# EAGLE design TeensyROM (EAGLE 7.7.0)
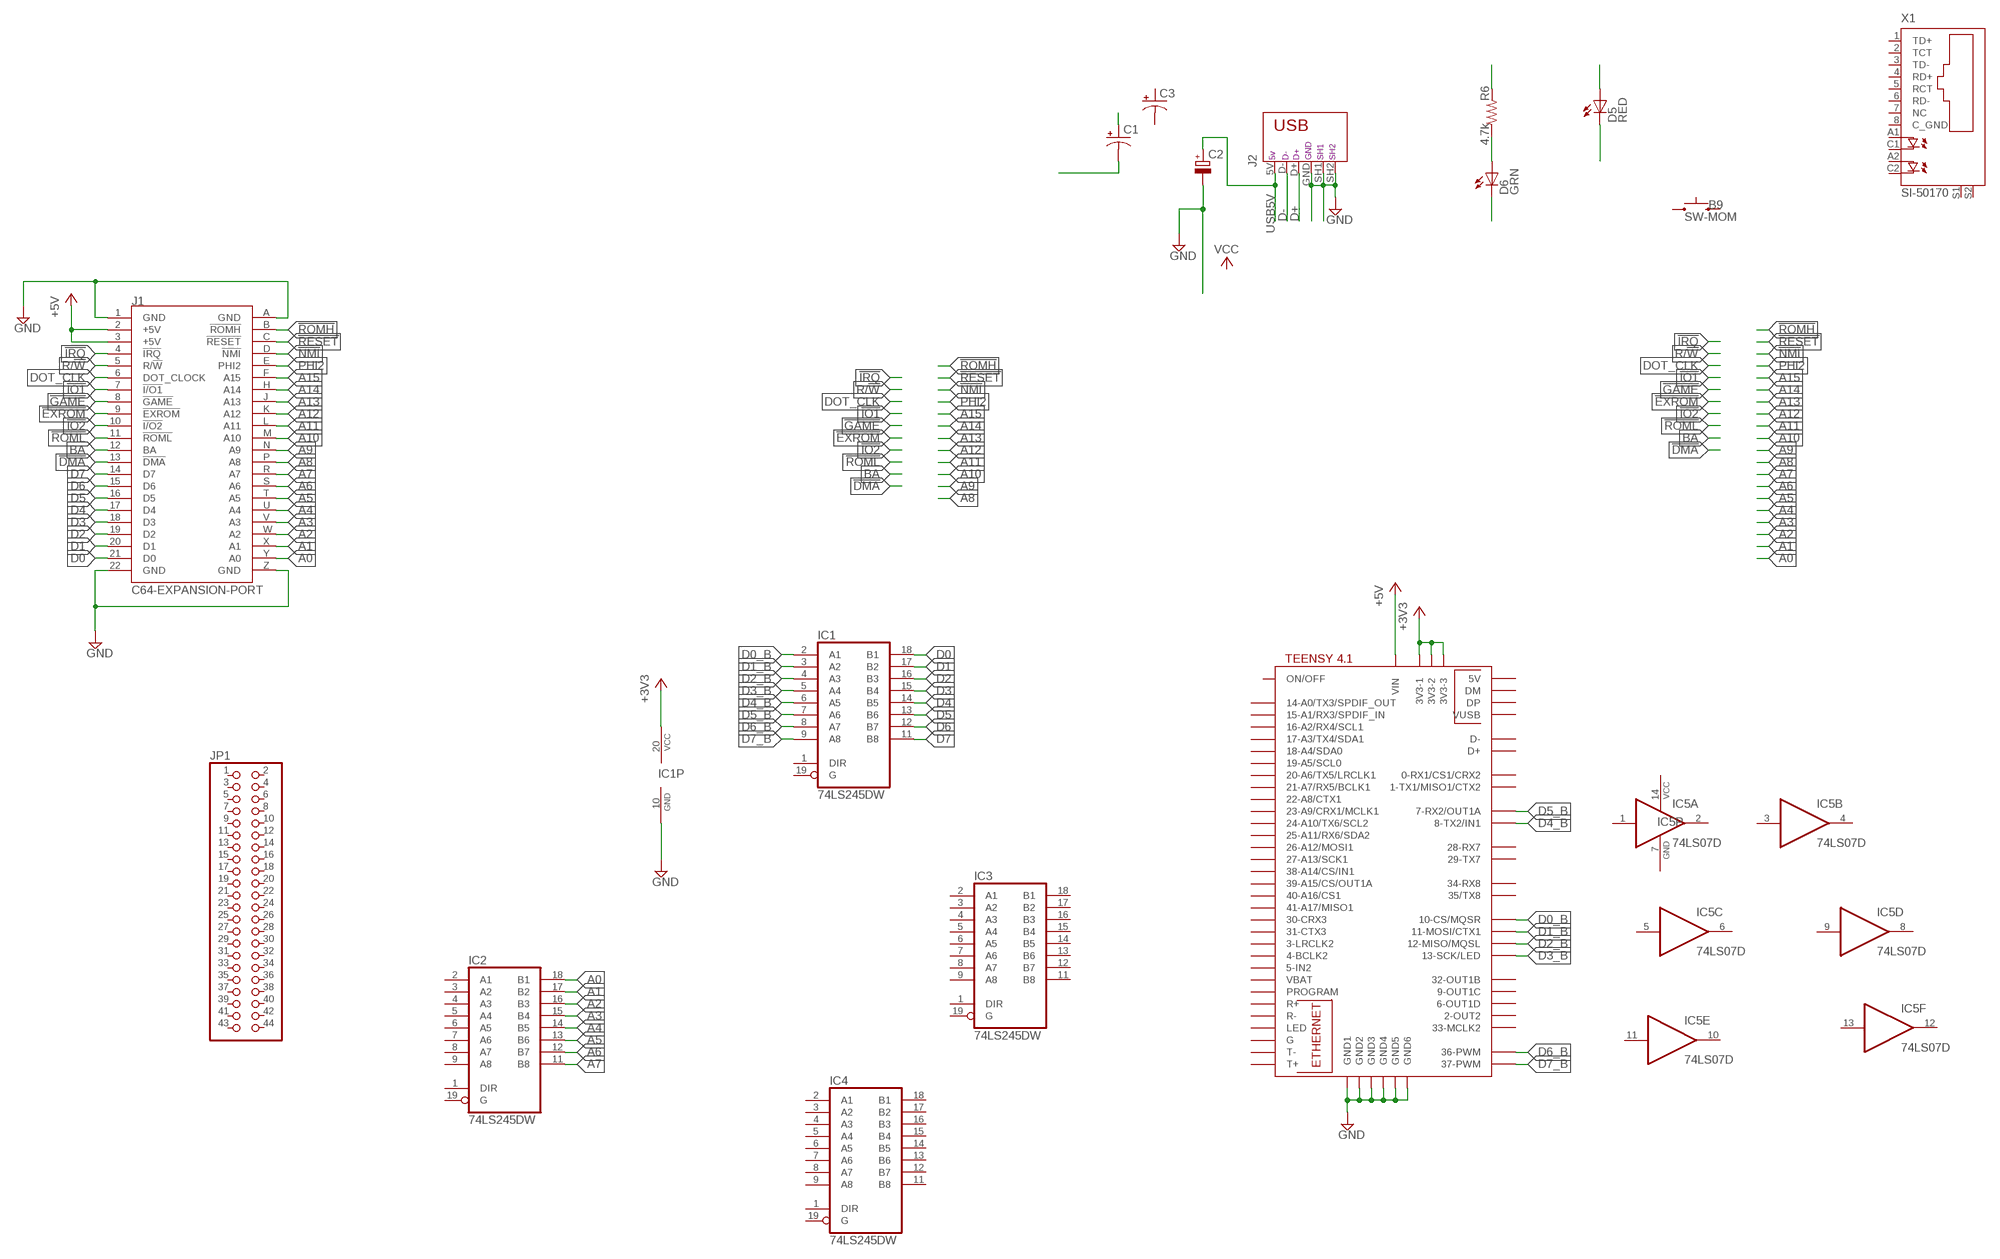
[diagram p0: schematic, sheet 1]

## Parts
B9  SW-MOM  SWITCH-MOMENTARY-2PTH  [TACTILE-PTH]
C1  CPOL-USE2.5-6  [E2,5-6]
C2  CPOL-EUA/3216-18W  [A/3216-18W]
C3  CPOL-USE2.5-6  [E2,5-6]
D5  RED  LED-3MM-RED  [LED-3MM-PTH]
D6  GRN  LED-3MM-GRN  [LED-3MM-PTH]
IC1  74LS245DW  [SO20W]
IC2  74LS245DW  [SO20W]
IC3  74LS245DW  [SO20W]
IC4  74LS245DW  [SO20W]
IC5  74LS07D  [SO14]
J1  C64-EXPANSION-PORT  C64-EXPANSIONPNARROW  [EXPANSIO_SQ]
J2  USB-787616  [USB]
JP1  PINHD-2X22  [2X22]
R6  4.7k  R-US_R0805  [R0805]
U$1  TEENSY41  [TEENSY41]
X1  SI-50170  [SI-50170]

## Nets
!DMA: J1.13(!DMA)
!EXROM: J1.9(!EXROM)
!GAME: J1.8(!GAME)
!IO1: J1.7(!I/O1)
!IO2: J1.10(!I/O2)
!IRQ: J1.4(!IRQ)
!NMI: J1.D(!NMI)
!RESET: J1.C(!RESET)
!ROMH: J1.B(!ROMH)
!ROML: J1.11(!ROML)
+3V3: IC1.20(VCC) U$1.3V3-1 U$1.3V3-2 U$1.3V3-3
+5V: J1.2(+5V) J1.3(+5V)
+5V1: C1.+
A0: IC2.18(B1) J1.Y(A0)
A1: IC2.17(B2) J1.X(A1)
A2: IC2.16(B3) J1.W(A2)
A3: IC2.15(B4) J1.V(A3)
A4: IC2.14(B5) J1.U(A4)
A5: IC2.13(B6) J1.T(A5)
A6: IC2.12(B7) J1.S(A6)
A7: IC2.11(B8) J1.R(A7)
A8: J1.P(A8)
A9: J1.N(A9)
A10: J1.M(A10)
A11: J1.L(A11)
A12: J1.K(A12)
A13: J1.J(A13)
A14: J1.H(A14)
A15: J1.F(A15)
B12: D5.K(C)
BA: J1.12(BA)
D0: IC1.18(B1) J1.21(D0)
D0_B: IC1.2(A1) U$1.10-CS\MQSR(10-CS/MQSR)
D1: IC1.17(B2) J1.20(D1)
D1_B: IC1.3(A2) U$1.11-MOSI/CTX1
D2: IC1.16(B3) J1.19(D2)
D2_B: IC1.4(A3) U$1.12-MISO/MQSL
D3: IC1.15(B4) J1.18(D3)
D3_B: IC1.5(A4) U$1.13-SCK/LED
D4: IC1.14(B5) J1.17(D4)
D4_B: IC1.6(A5) U$1.8-TX2/IN1
D5: IC1.13(B6) J1.16(D5)
D5_B: IC1.7(A6) U$1.7-RX2/OUT1A
D6: IC1.12(B7) J1.15(D6)
D6_B: IC1.8(A7) U$1.36-PWM
D7: IC1.11(B8) J1.14(D7)
D7_B: IC1.9(A8) U$1.37-PWM
D+: J2.D+
D-: J2.D-
DOT_CLK: J1.6(DOT_CLOCK)
GND: C2.- IC1.10(GND) J1.1(GND) J1.22(GND) J2.GND J2.SH1 J2.SH2 U$1.GND1 U$1.GND2 U$1.GND3 U$1.GND4 U$1.GND5 U$1.GND6
GND1: J1.A(GND) J1.Z(GND)
GND2: D6.K(C)
GND3: C1.-
N$1: D6.A R6.1
N$5: D5.A
PHI2: J1.E(PHI2)
R/!W: J1.5(R/!W)
USB5V: C2.+ J2.5V
VCC1 [vcc]: R6.2
Unconnected: B9.1 B9.3 C3.+ C3.- IC1.1(DIR) IC1.19(G) IC2.1(DIR) IC2.2(A1) IC2.3(A2) IC2.4(A3) IC2.5(A4) IC2.6(A5) IC2.7(A6) IC2.8(A7) IC2.9(A8) IC2.19(G) IC3.1(DIR) IC3.2(A1) IC3.3(A2) IC3.4(A3) IC3.5(A4) IC3.6(A5) IC3.7(A6) IC3.8(A7) IC3.9(A8) IC3.11(B8) IC3.12(B7) IC3.13(B6) IC3.14(B5) IC3.15(B4) IC3.16(B3) IC3.17(B2) IC3.18(B1) IC3.19(G) IC4.1(DIR) IC4.2(A1) IC4.3(A2) IC4.4(A3) IC4.5(A4) IC4.6(A5) IC4.7(A6) IC4.8(A7) IC4.9(A8) IC4.11(B8) IC4.12(B7) IC4.13(B6) IC4.14(B5) IC4.15(B4) IC4.16(B3) IC4.17(B2) IC4.18(B1) IC4.19(G) IC5.1(A:I) IC5.2(A:O) IC5.3(B:I) IC5.4(B:O) IC5.5(C:I) IC5.6(C:O) IC5.8(D:O) IC5.9(D:I) IC5.10(E:O) IC5.11(E:I) IC5.12(F:O) IC5.13(F:I) JP1.1 JP1.2 JP1.3 JP1.4 JP1.5 JP1.6 JP1.7 JP1.8 JP1.9 JP1.10 JP1.11 JP1.12 JP1.13 JP1.14 JP1.15 JP1.16 JP1.17 JP1.18 JP1.19 JP1.20 JP1.21 JP1.22 JP1.23 JP1.24 JP1.25 JP1.26 JP1.27 JP1.28 JP1.29 JP1.30 JP1.31 JP1.32 JP1.33 JP1.34 JP1.35 JP1.36 JP1.37 JP1.38 JP1.39 JP1.40 JP1.41 JP1.42 JP1.43 JP1.44 U$1.0-RX1/CS1/CRX2 U$1.1-TX1/MISO1/CTX2 U$1.2-OUT2 U$1.3-LRCLK2 U$1.4-BCLK2 U$1.5-IN2 U$1.6-OUT1D U$1.9-OUT1C U$1.14-A0/TX3/SPDIF_OUT U$1.15-A1/RX3/SPDIF_IN U$1.16-A2/RX4/SCL1 U$1.17-A3/TX4/SDA1 U$1.18-A4/SDA0 U$1.19-A5/SCL0 U$1.20-A6/TX5/LRCLK1 U$1.21-A7/RX5/BCLK1 U$1.22-A8/CTX1 U$1.23-A9/CRX1/MCLK1 U$1.24-A10/TX6/SCL2 U$1.25-A11/RX6/SDA2 U$1.26-A12/MOSI1 U$1.27-A13/SCK1 U$1.28-RX7 U$1.29-TX7 U$1.30-CRX3 U$1.31-CTX3 U$1.32-OUT1B U$1.33-MCLK2 U$1.34-RX8 U$1.35-TX8(35/TX8) U$1.38-A14/CS/IN1 U$1.39-A15/CS/OUT1A U$1.40-A16/CS1 U$1.41-A17/MISO1 U$1.+5V(5V) U$1.D+ U$1.D- U$1.DM U$1.DP U$1.G U$1.LED U$1.ON/OFF U$1.PROGRAM U$1.R+ U$1.R- U$1.T+ U$1.T- U$1.VBAT U$1.VIN U$1.VUSB X1.1(TD+) X1.2(TCT) X1.3(TD-) X1.4(RD+) X1.5(RCT) X1.6(RD-) X1.7(NC) X1.8(C_GND) X1.A1(A) X1.A2(A1) X1.C1(C) X1.C2(C1) X1.S1 X1.S2

## Power pins joined to a net without a drawn wire
GND: IC2.10(GND) IC3.10(GND) IC4.10(GND) IC5.7(P:GND)
VCC: IC2.20(VCC) IC3.20(VCC) IC4.20(VCC) IC5.14(P:VCC)

## Library data of the parts
B9 = AudioLooper:SWITCH-MOMENTARY-2
C1 C3 = rcl:CPOL-US: POLARIZED CAPACITOR, American symbol
C2 = rcl:CPOL-EU: POLARIZED CAPACITOR, European symbol
D5 = Dolphin v3.20:LED-3MM-: LED 3.1MM PTH; DIGIKEY: 511-1249-ND; MANUF1: ROHM; MPN1: SLR-342VC3F
D6 = Dolphin v3.20:LED-3MM-: LED 3.1MM PTH; DIGIKEY: 516-1293-ND; MANUF1: Broadcom Limited; MPN1: HLMP-1503
IC1-IC4 = 74xx-us:74*245: Octal BUS TRANSCEIVER, 3-state
IC5 = 74xx-us:74*07: Hex BUFFER, open collector high-voltage output
J1 = Commodore:C64-EXPANSIONP
J2 = AudioLooper:USB-787616: AMP connector
JP1 = pinhead:PINHD-2X22: PIN HEADER
R6 = resistor:R-US_: RESISTOR, American symbol
U$1 = teensy:TEENSY41
X1 = con-stewart:SI-50170: Ethernet Connector MagJack (R) Source: www.stewartconnector.com .. si-50170.pdf; OC_FARNELL: unknown; OC_NEWARK: unknown

## Net classes
1 vcc: width 0.254 mm

## Board
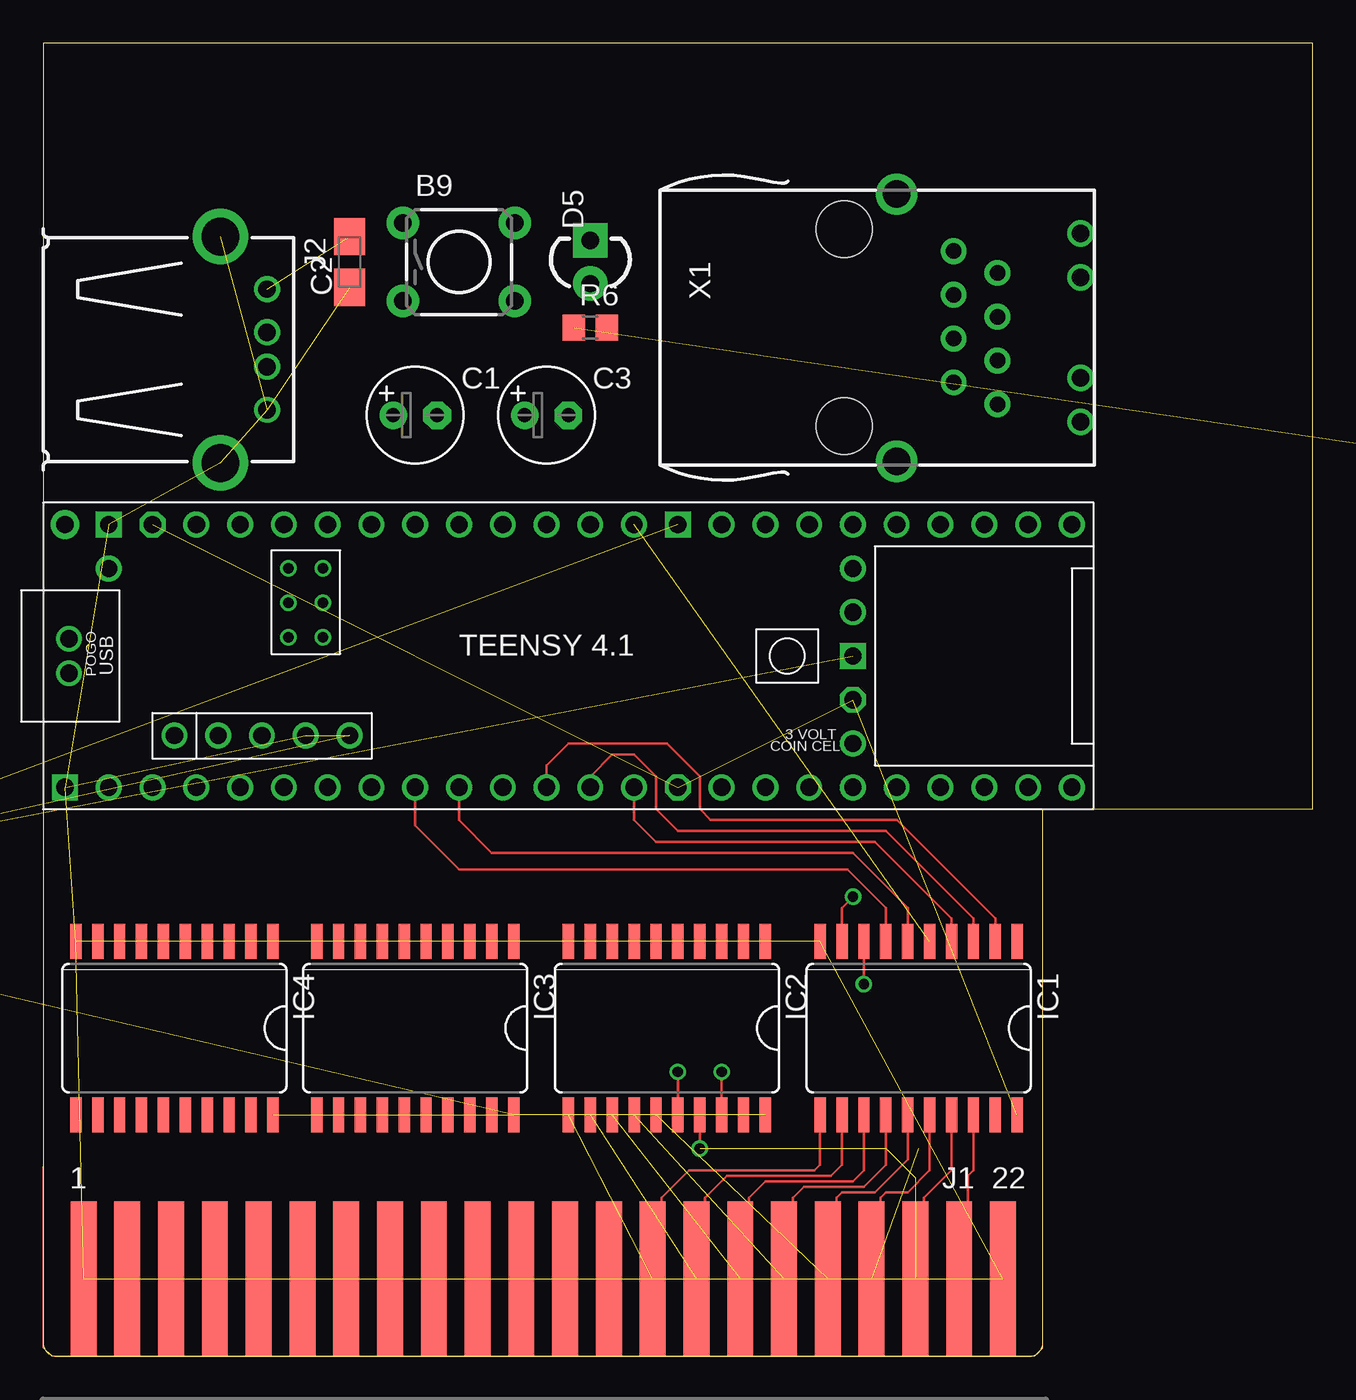
[diagram p1: board, top side]
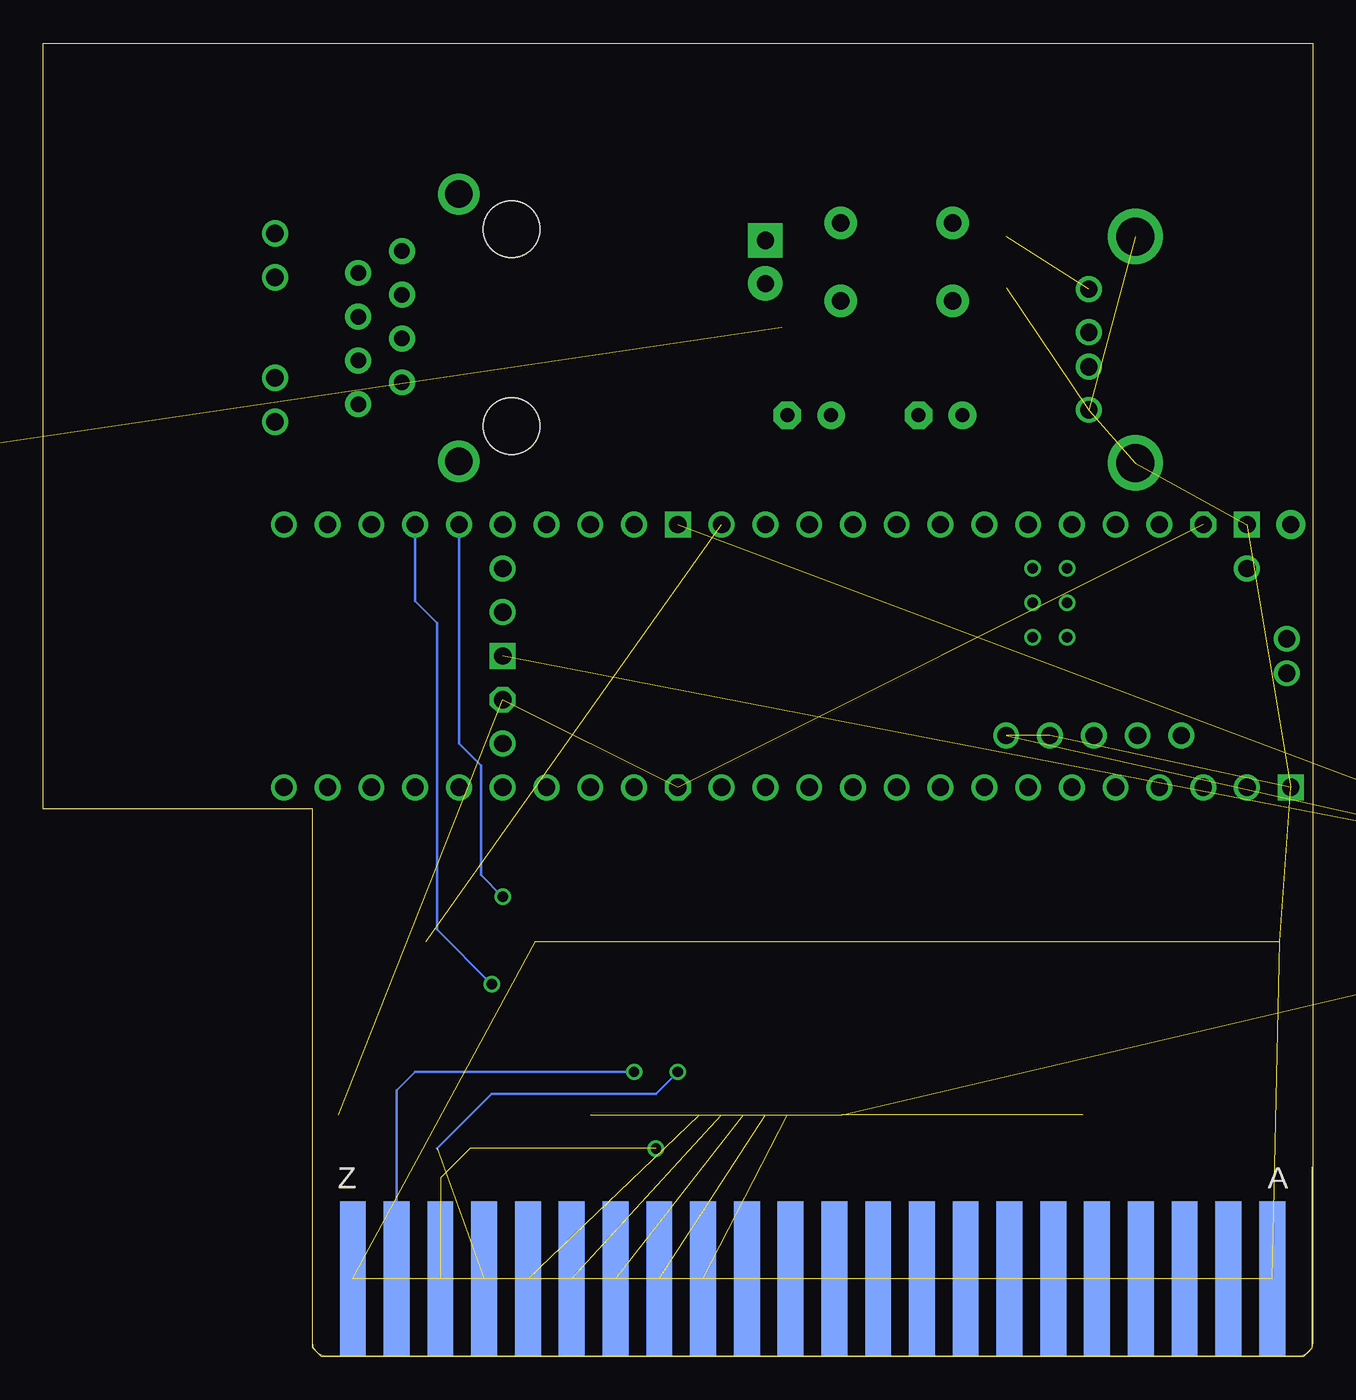
[diagram p2: board, bottom side, seen from below]

Size 73.66 x 76.2 mm. Coordinates in mm from the lower left corner, seen from the top.
Outline: 0,76.2 0,0.83 arc90 0.83,0 57.19,0 arc90 58.01,0.83 58.01,31.75 73.66,31.75 73.66,76.2 0,76.2
Copper layers (1*16): Top 0.0356mm / dielectric 1.5011mm / Bottom 0.0356mm
Design rules "oshpark-2layer": minimum track width 6mil, minimum drill 13mil, track to track 6mil, track to pad 6mil, pad to pad 6mil, via to via 6mil, smd to smd 6mil, copper to edge 15mil, drill to drill 6mil, minimum pad ring 7mil, minimum via ring 7mil, stop-mask expansion 2.5mil, vias tented up to drill 0mil, thermal gap 10mil

### Footprints (pad centres in the part's own frame; a part is rotated, then mirrored left to right if it is on the bottom)
TACTILE-PTH = drill 1.016 pad 1.88: 1 -3.251,2.261; 2 3.251,2.261; 3 -3.251,-2.261; 4 3.251,-2.261
E2,5-6 = drill 0.813 pad 1.6: + -1.27,0 | drill 0.813 pad 1.6 octagon: - 1.27,0
A/3216-18W = smd 2.15 x 1.8: + 1.475,0; - -1.475,0
LED-3MM-PTH = drill 1 pad 2: A -1.25,0 | drill 1 pad 2 square: K 1.25,0
SO20W = smd 0.66 x 2.032: 1 -5.715,-5.029; 2 -4.445,-5.029; 3 -3.175,-5.029; 4 -1.905,-5.029; 5 -0.635,-5.029; 6 0.635,-5.029; 7 1.905,-5.029; 8 3.175,-5.029; 9 4.445,-5.029; 10 5.715,-5.029; 11 5.715,5.029; 12 4.445,5.029; 13 3.175,5.029; 14 1.905,5.029; 15 0.635,5.029; 16 -0.635,5.029; 17 -1.905,5.029; 18 -3.175,5.029; 19 -4.445,5.029; 20 -5.715,5.029
SO14 = smd 0.66 x 2.032: 1 -3.81,-3.073; 2 -2.54,-3.073; 3 -1.27,-3.073; 4 0,-3.073; 5 1.27,-3.073; 6 2.54,-3.073; 7 3.81,-3.073; 8 3.81,3.073; 9 2.54,3.073; 10 1.27,3.073; 11 0,3.073; 12 -1.27,3.073; 13 -2.54,3.073; 14 -3.81,3.073
EXPANSIO_SQ = smd 1.5 x 9: 1 26.67,-4.5; 2 24.13,-4.5; 3 21.59,-4.5; 4 19.05,-4.5; 5 16.51,-4.5; 6 13.97,-4.5; 7 11.43,-4.5; 8 8.89,-4.5; 9 6.35,-4.5; 10 3.81,-4.5; 11 1.27,-4.5; 12 -1.27,-4.5; 13 -3.81,-4.5; 14 -6.35,-4.5; 15 -8.89,-4.5; 16 -11.43,-4.5; 17 -13.97,-4.5; 18 -16.51,-4.5; 19 -19.05,-4.5; 20 -21.59,-4.5; 21 -24.13,-4.5; 22 -26.67,-4.5 | smd 1.5 x 9 bottom: A 26.67,-4.5; B 24.13,-4.5; C 21.59,-4.5; D 19.05,-4.5; E 16.51,-4.5; F 13.97,-4.5; H 11.43,-4.5; J 8.89,-4.5; K 6.35,-4.5; L 3.81,-4.5; M 1.27,-4.5; N -1.27,-4.5; P -3.81,-4.5; R -6.35,-4.5; S -8.89,-4.5; T -11.43,-4.5; U -13.97,-4.5; V -16.51,-4.5; W -19.05,-4.5; X -21.59,-4.5; Y -24.13,-4.5; Z -26.67,-4.5
USB = drill 1: 5V -3.5,12.99; D+ 1,12.99; D- -1,12.99; GND 3.5,12.99 | drill 2.2: SH1 -6.553,10.287; SH2 6.579,10.287
2X22 = drill 1.016 octagon: 1 -25.4,-1.27; 2 -25.4,1.27; 3 -22.86,-1.27; 4 -22.86,1.27; 5 -20.32,-1.27; 6 -20.32,1.27; 7 -17.78,-1.27; 8 -17.78,1.27; 9 -15.24,-1.27; 10 -15.24,1.27; 11 -12.7,-1.27; 12 -12.7,1.27; 13 -10.16,-1.27; 14 -10.16,1.27; 15 -7.62,-1.27; 16 -7.62,1.27; 17 -5.08,-1.27; 18 -5.08,1.27; 19 -2.54,-1.27; 20 -2.54,1.27; 21 0,-1.27; 22 0,1.27; 23 2.54,-1.27; 24 2.54,1.27; 25 5.08,-1.27; 26 5.08,1.27; 27 7.62,-1.27; 28 7.62,1.27; 29 10.16,-1.27; 30 10.16,1.27; 31 12.7,-1.27; 32 12.7,1.27; 33 15.24,-1.27; 34 15.24,1.27; 35 17.78,-1.27; 36 17.78,1.27; 37 20.32,-1.27; 38 20.32,1.27; 39 22.86,-1.27; 40 22.86,1.27; 41 25.4,-1.27; 42 25.4,1.27; 43 27.94,-1.27; 44 27.94,1.27
R0805 = smd 1.3 x 1.5: 1 -0.95,0; 2 0.95,0
TEENSY41 = drill 1: 0-RX1/CS1/CRX2 -27.94,-7.62; 1-TX1/MISO1/CTX2 -25.4,-7.62; 2-OUT2 -22.86,-7.62; 3-LRCLK2 -20.32,-7.62; 4-BCLK2 -17.78,-7.62; 5-IN2 -15.24,-7.62; 6-OUT1D -12.7,-7.62; 7-RX2/OUT1A -10.16,-7.62; 8-TX2/IN1 -7.62,-7.62; 9-OUT1C -5.08,-7.62; 10-CS\MQSR -2.54,-7.62; 11-MOSI/CTX1 0,-7.62; 12-MISO/MQSL 2.54,-7.62; 13-SCK/LED 2.54,7.62; 14-A0/TX3/SPDIF_OUT 0,7.62; 15-A1/RX3/SPDIF_IN -2.54,7.62; 16-A2/RX4/SCL1 -5.08,7.62; 17-A3/TX4/SDA1 -7.62,7.62; 18-A4/SDA0 -10.16,7.62; 19-A5/SCL0 -12.7,7.62; 20-A6/TX5/LRCLK1 -15.24,7.62; 21-A7/RX5/BCLK1 -17.78,7.62; 22-A8/CTX1 -20.32,7.62; 23-A9/CRX1/MCLK1 -22.86,7.62; 24-A10/TX6/SCL2 7.62,-7.62; 25-A11/RX6/SDA2 10.16,-7.62; 26-A12/MOSI1 12.7,-7.62; 27-A13/SCK1 15.24,-7.62; 28-RX7 17.78,-7.62; 29-TX7 20.32,-7.62; 30-CRX3 22.86,-7.62; 31-CTX3 25.4,-7.62; 32-OUT1B 27.94,-7.62; 33-MCLK2 27.94,7.62; 34-RX8 25.4,7.62; 35-TX8 22.86,7.62; 36-PWM 20.32,7.62; 37-PWM 17.78,7.62; 38-A14/CS/IN1 15.24,7.62; 39-A15/CS/OUT1A 12.7,7.62; 40-A16/CS1 10.16,7.62; 41-A17/MISO1 7.62,7.62; +5V -24.13,-4.62; D+ -30.25,-1; D- -30.25,1; DM -21.59,-4.62; DP -19.05,-4.62; GND4 -16.51,-4.62; GND5 -13.97,-4.62; ON/OFF 15.24,5.08; PROGRAM 15.24,2.54; VBAT 15.24,-5.08; VUSB -27.94,5.08 | drill 1 octagon: 3V3-1 5.08,-7.62; 3V3-2 15.24,-2.54; 3V3-3 -25.4,7.62 | drill 0.6: G -15.51,3.08; LED -17.51,3.08; R+ -17.51,5.08; R- -15.51,5.08; T+ -15.51,1.08; T- -17.51,1.08 | drill 1 square: GND1 -30.48,-7.62; GND2 15.24,0; GND3 5.08,7.62; GND6 -27.94,7.62 | drill 1 pad 1.676: VIN -30.48,7.62
SI-50170 = drill 0.9 pad 1.5: 1 4.445,5.842; 2 3.175,3.302; 3 1.905,5.842; 4 0.635,3.302; 5 -0.635,5.842; 6 -1.905,3.302; 7 -3.175,5.842; 8 -4.445,3.302 | drill 1.016 pad 1.5: A1 -5.461,10.668; A2 2.921,10.668; C1 -2.921,10.668; C2 5.461,10.668 | drill 1.6 pad 2.2: S1 -7.747,0; S2 7.747,0 | hole 3.251: -5.715,-3.048; 5.715,-3.048

### Placement (x,y rotation side)
B9  24.13,63.5 0 top
C1  21.59,54.61 0 top
C2  17.78,63.5 90 top
C3  29.21,54.61 0 top
D5  31.75,63.5 90 top
D6  118.11,46.99 0 top  (outside the outline)
IC1  50.8,19.05 180 top
IC2  36.2,19.05 180 top
IC3  21.59,19.05 180 top
IC4  7.62,19.05 180 top
IC5  -12.06,25.4 180 top  (outside the outline)
J1  29.02,0 180 top
J2  0,58.42 270 top
JP1  30.48,-16.51 0 top  (outside the outline)
R6  31.75,59.69 0 top
U$1  31.75,40.64 0 top
X1  49.53,59.69 270 top

### Tracks (layer width: path | path; a pad name or v marks a point on that pad's centre or on a via)
+3V3  (3 unrouted)
+5V  (1 unrouted)
A0  (via drill 0.6)
  Top 0.152: IC2.18 v39.37,16.51
  Bottom 0.152: v39.37,16.51 52.07,16.51 53.15,15.43 J1.Y
A1  (via drill 0.6)  (3 unrouted)
  Top 0.152: IC2.17 v38.1,12.06
A2  (via drill 0.6)  (1 unrouted)
  Top 0.152: IC2.16 v36.83,16.51
  Bottom 0.152: v36.83,16.51 38.1,15.24 47.62,15.24 50.8,12.06
A3  (1 unrouted)
A4  (1 unrouted)
A5  (1 unrouted)
A6  (1 unrouted)
A7  (1 unrouted)
D0
  Top 0.152: J1.21 53.66,5.01 53.66,10.48 53.98,10.79 IC1.18
D0_B
  Top 0.152: IC1.2 55.24,25.4 49.53,31.11 38.73,31.11 38.1,31.75 38.1,33.66 36.2,35.56 30.48,35.56 29.21,34.29 U$1.10-CS\MQSR
D1
  Top 0.152: J1.20 51.12,5.01 51.12,9.21 52.7,10.79 IC1.17
D1_B
  Top 0.152: IC1.3 53.98,25.4 48.9,30.48 36.83,30.48 35.56,31.75 35.56,33.66 34.29,34.92 33.02,34.92 31.75,33.66 U$1.11-MOSI/CTX1
D2
  Top 0.152: J1.19 48.58,5.01 48.58,9.21 48.9,9.53 50.16,9.53 51.44,10.79 IC1.16
D2_B
  Top 0.152: IC1.4 52.7,25.4 48.26,29.84 35.56,29.84 34.29,31.11 U$1.12-MISO/MQSL
D3
  Top 0.152: J1.18 46.04,5.01 46.04,9.21 46.35,9.53 48.26,9.53 50.16,11.43 IC1.15
D3_B  (1 unrouted)
D4
  Top 0.152: J1.17 43.5,5.01 43.5,9.21 44.13,9.84 47.62,9.84 48.9,11.11 IC1.14
D4_B
  Top 0.152: IC1.6 50.16,26.04 46.99,29.21 26.04,29.21 24.13,31.11 U$1.8-TX2/IN1
D5
  Top 0.152: J1.16 40.96,5.01 40.96,9.21 41.91,10.16 46.99,10.16 47.62,10.79 IC1.13
D5_B
  Top 0.152: IC1.7 48.9,26.04 46.67,28.26 24.13,28.26 21.59,30.8 U$1.7-RX2/OUT1A
D6
  Top 0.152: J1.15 38.42,5.01 38.42,9.21 39.69,10.48 45.72,10.48 46.35,11.11 IC1.12
D6_B  (via drill 0.6)
  Top 0.152: IC1.8 v47.62,21.59
  Bottom 0.152: v47.62,21.59 50.8,24.77 50.8,42.55 52.07,43.81 U$1.36-PWM
D7
  Top 0.152: J1.14 35.88,4.5 35.88,9.21 37.47,10.79 44.77,10.79 45.09,11.11 IC1.11
D7_B  (via drill 0.6)
  Top 0.152: IC1.9 46.35,26.04 v46.99,26.67
  Bottom 0.152: v46.99,26.67 48.26,27.94 48.26,34.29 49.53,35.56 U$1.37-PWM
GND  (16 unrouted)
GND1  (1 unrouted)
N$1  (1 unrouted)
USB5V  (1 unrouted)
VCC  (3 unrouted)